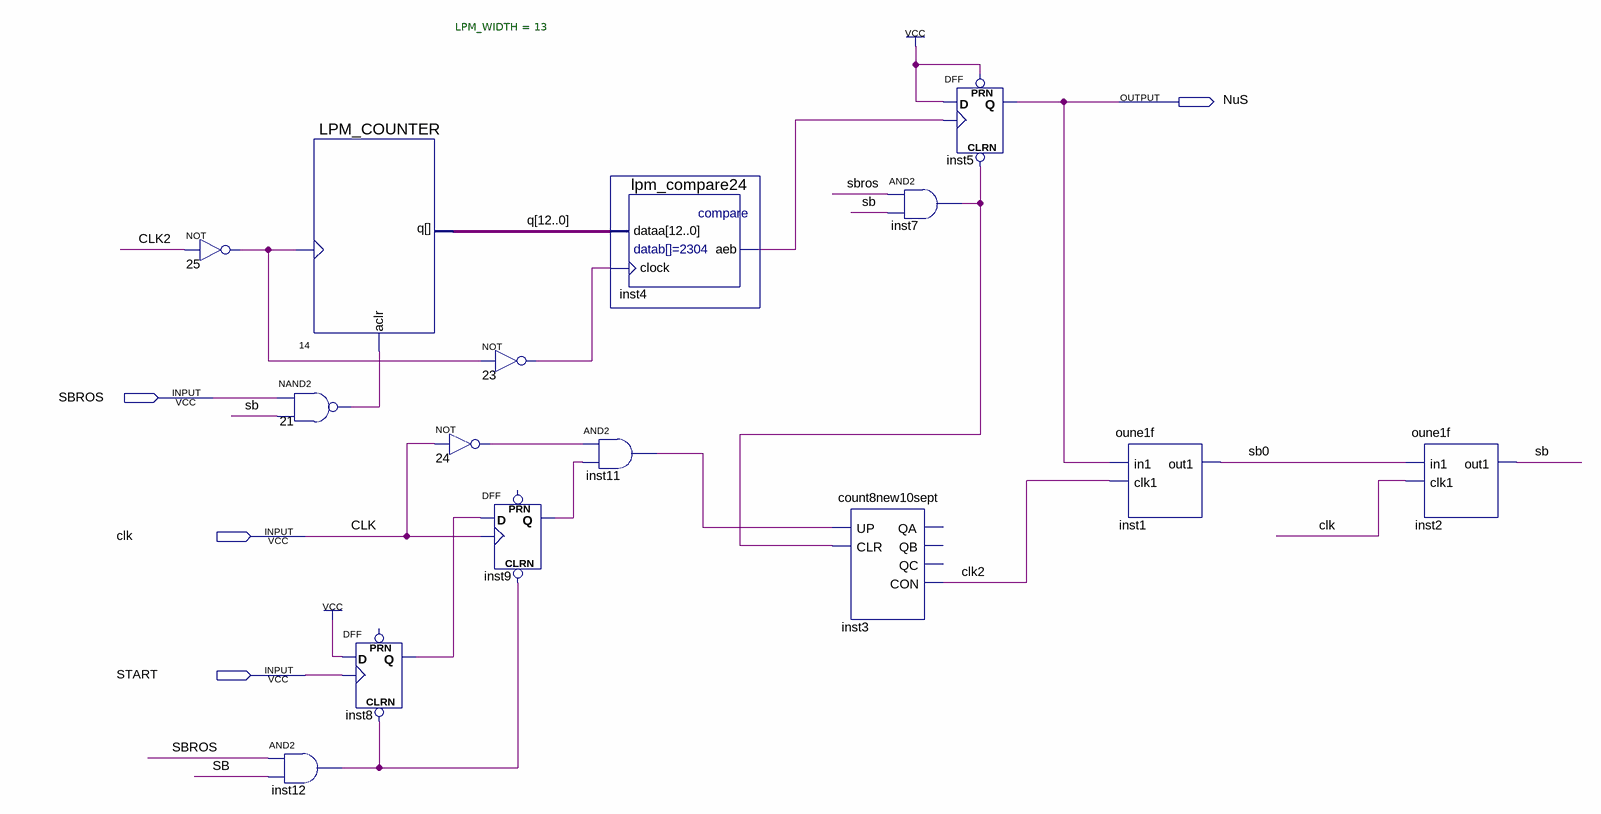
[diagram p0: schematic sheet]
// Quartus schematic zader450_25jen.bdf as structural Verilog: 15 symbols, 4 pins
module zader450_25jen (
  input  SBROS,
  input  clk,
  input  START,
  output NuS
);

  wire CLK2, inst4_aeb, inst7_out, inst8_q, inst9_q, inst11_out, inst12_out, n21_out, n23_out, n24_out,
       n25_out, sb, sb0;
  wire [12:0] q;

  not u_25 (n25_out, CLK2);
  LPM_COUNTER #(.LPM_WIDTH(13)) u_14 (.clock(n25_out), .aclr(n21_out), .q(q));
  nand u_21 (n21_out, SBROS, sb);
  and inst12 (inst12_out, SBROS, sb);
  DFF inst8 (.CLRN(inst12_out), .CLK(START), .D(1'b1), .Q(inst8_q));  // open: PRN
  not u_24 (n24_out, clk);
  not u_23 (n23_out, n25_out);
  DFF inst9 (.CLRN(inst12_out), .CLK(clk), .D(inst8_q), .Q(inst9_q));  // open: PRN
  lpm_compare24 inst4 (.dataa(q), .clock(n23_out), .aeb(inst4_aeb));
  and inst11 (inst11_out, n24_out, inst9_q);
  count8new10sept inst3 (.UP(inst11_out), .CLR(inst7_out), .CON(CLK2));  // open: QA, QB, QC
  and inst7 (inst7_out, SBROS, sb);
  DFF inst5 (.CLRN(inst7_out), .CLK(inst4_aeb), .D(1'b1), .PRN(1'b1), .Q(NuS));
  oune1f inst1 (.in1(NuS), .clk1(CLK2), .out1(sb0));
  oune1f inst2 (.in1(sb0), .clk1(clk), .out1(sb));
endmodule
